# EAGLE schematic ATmega168_Nidec22H_BLDC_Motor (EAGLE 6.5.0)
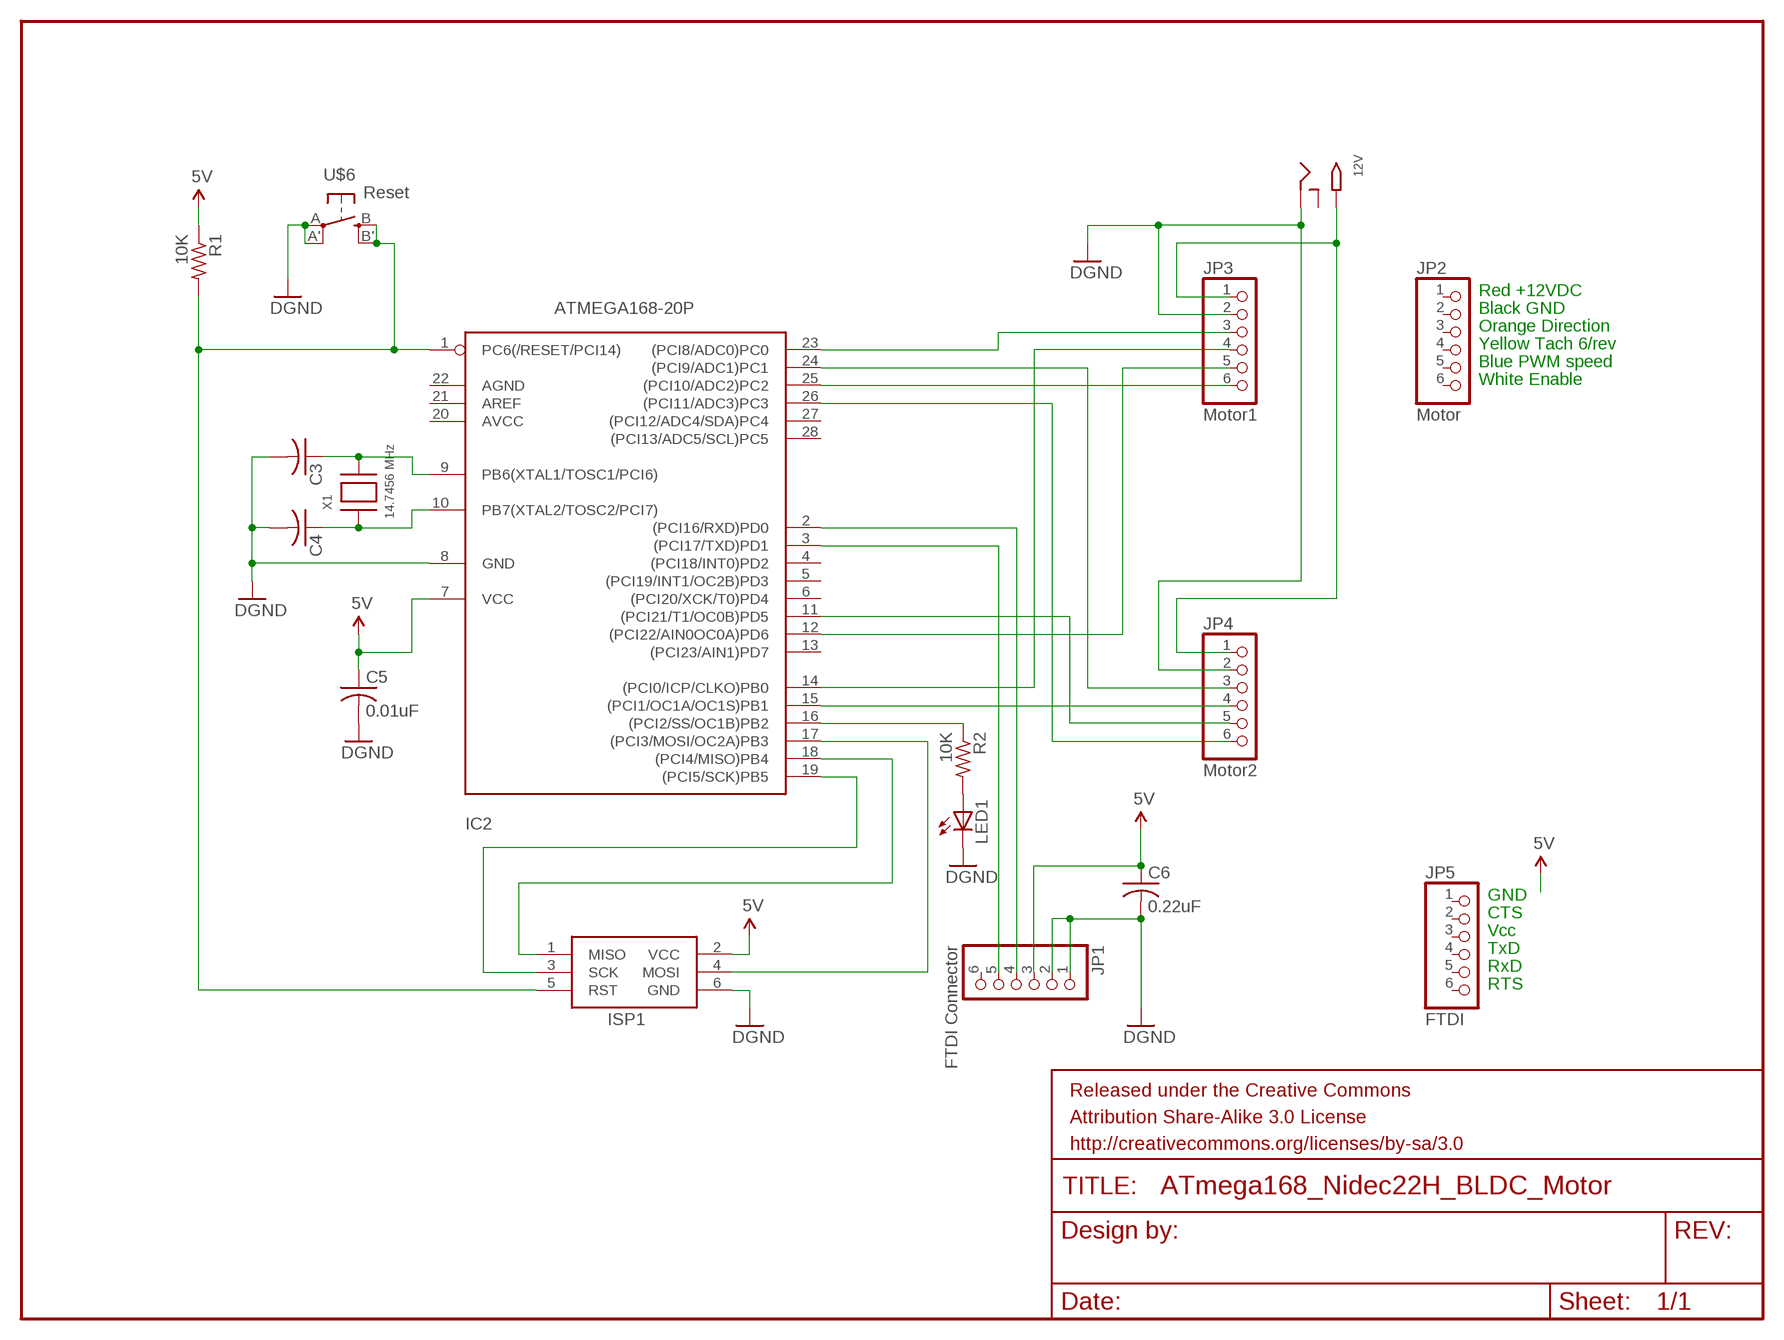
[diagram p0: schematic, sheet 1]

## Parts
12V  2.1MMJACKSMT  [DCJACK_2MM_SMT]
C3  C-US025-024X044  [C025-024X044]
C4  C-US025-024X044  [C025-024X044]
C5  0.01uF  C-US025-024X044  [C025-024X044]
C6  0.22uF  C-US025-024X044  [C025-024X044]
IC2  ATMEGA168-20P  [DIL28-3]
ISP1  AVRISP-6  [AVRISP]
JP1  FTDI Connector  PINHD-1X6  [1X06]
JP2  Motor  PINHD-1X6  [1X06]
JP3  Motor1  PINHD-1X6  [1X06]
JP4  Motor2  PINHD-1X6  [1X06]
JP5  FTDI  PINHD-1X6  [1X06]
LED1  LED5MM  [LED5MM]
R1  10K  R-US_V234/12  [V234/12]
R2  10K  R-US_V234/12  [V234/12]
U$6  Reset  EVQQ2  [EVQ-Q2]
X1  14.7456 MHz  XTALNX8045  [NX8045]

## Nets
5V: C5.1 C6.1 IC2.7(VCC) ISP1.2(VCC) JP1.3 R1.1
24V: 12V.PWR2(TIP) JP3.1 JP4.1
DIR-1: IC2.23((PCI8/ADC0)PC0) JP3.3
DIR-2: IC2.24((PCI9/ADC1)PC1) JP4.3
EN-1: IC2.25((PCI10/ADC2)PC2) JP3.6
EN-2: IC2.26((PCI11/ADC3)PC3) JP4.6
GND: 12V.GND(RING) C3.2 C4.2 C5.2 C6.2 IC2.8(GND) ISP1.6(GND) JP1.1 JP1.2 JP3.2 JP4.2 LED1.K(C) U$6.A'(P1) U$6.A(P) ; supply symbol labelled DGND
MISO: IC2.18((PCI4/MISO)PB4) ISP1.1(MISO)
MOSI: IC2.17((PCI3/MOSI/OC2A)PB3) ISP1.4(MOSI)
N$1: IC2.16((PCI2/SS/OC1B)PB2) R2.1
N$3: C3.1 IC2.9(PB6(XTAL1/TOSC1/PCI6)) X1.P$2
N$4: C4.1 IC2.10(PB7(XTAL2/TOSC2/PCI7)) X1.P$1
N$13: LED1.A R2.2
PWM-1: IC2.12((PCI22/AIN0OC0A)PD6) JP3.5
PWM-2: IC2.11((PCI21/T1/OC0B)PD5) JP4.5
RST: IC2.1(PC6(/RESET/PCI14)) ISP1.5(RST) R1.2 U$6.B'(S1) U$6.B(S)
RXD: IC2.3((PCI17/TXD)PD1) JP1.5
SCK: IC2.19((PCI5/SCK)PB5) ISP1.3(SCK)
TACH-1: IC2.14((PCI0/ICP/CLKO)PB0) JP3.4
TACH-2: IC2.15((PCI1/OC1A/OC1S)PB1) JP4.4
TXD: IC2.2((PCI16/RXD)PD0) JP1.4
Unconnected: 12V.GNDBREAK(RING_SW) IC2.4((PCI18/INT0)PD2) IC2.5((PCI19/INT1/OC2B)PD3) IC2.6((PCI20/XCK/T0)PD4) IC2.13((PCI23/AIN1)PD7) IC2.20(AVCC) IC2.21(AREF) IC2.22(AGND) IC2.27((PCI12/ADC4/SDA)PC4) IC2.28((PCI13/ADC5/SCL)PC5) JP1.6 JP2.1 JP2.2 JP2.3 JP2.4 JP2.5 JP2.6 JP5.1 JP5.2 JP5.3 JP5.4 JP5.5 JP5.6

## Notes on the sheet
- Red +12VDC
- Black GND
- Orange Direction
- Yellow Tach 6/rev
- Blue PWM speed
- White Enable
- GND
- CTS
- Vcc
- TxD
- RxD
- RTS

## Library data of the parts
12V = adafruit:2.1MMJACK: 2.1mm x 5.5mm THM DC jack with internal switch. Digikey part #PJ-102A, 4UCON part #05537 2.1mm x 5.5mm SMT DC jack with internal switch. Digikey part #PJ-002A-SMT, 4UCON part #03267 By microbuilder.eu & adafruit.com
C3-C6 = rcl:C-US: CAPACITOR, American symbol
IC2 = adafruit:ATMEGA168*P: MICROCONTROLLER 16 kBytes FLASH 1 kBytes SRAM 512 Bytes EEPROM USART 8-channel 10 bit ADC
ISP1 = adafruit:AVRISP: AVR ISP HEADER Standard 6 pin header for AVR programming
JP1-JP5 = adafruit:PINHD-1X6: PIN HEADER
LED1 = adafruit:LED: LED OSRAM: - CHIPLED LG R971, LG N971, LY N971, LG Q971, LY Q971, LO R971, LY R971 LH N974, LH R974 LS Q976, LO Q976, LY Q976 LO Q996 - Hyper CHIPLED LW Q18S LB Q993, LB Q99A, LB R99A - SideLED LS A670, LO A670, LY A670, LG A670, LP A670 LB A673, LV A673, LT A673, LW A673 LH A674 LY A675 LS A676, LA A676, LO A676, LY A676, LW A676 LS A679, LY A679, LG A679 - Hyper Micro SIDELED® LS Y876, LA Y876, LO Y876, LY Y876 LT Y87S - SmartLED LW L88C, LW L88S LB L89C, LB L89S, LG L890 LS L89K, LO L89K, LY L89K LS L896, LA L896, LO L896, LY L896 - TOPLED LS T670, LO T670, LY T670, LG T670, LP T670 LSG T670, LSP T670, LSY T670, LOP T670, LYG T670 LG T671, LOG T671, LSG T671 LB T673, LV T673, LT T673, LW T673 LH T674 LS T676, LA T676, LO T676, LY T676, LB T676, LH T676, LSB T676, LW T676 LB T67C, LV T67C, LT T67C, LS T67K, LO T67K, LY T67K, LW E67C LS E67B, LA E67B, LO E67B, LY E67B, LB E67C, LV E67C, LT E67C LW T67C LS T679, LY T679, LG T679 LS T770, LO T770, LY T770, LG T770, LP T770 LB T773, LV T773, LT T773, LW T773 LH T774 LS E675, LA E675, LY E675, LS T675 LS T776, LA T776, LO T776, LY T776, LB T776 LHGB T686 LT T68C, LB T68C - Hyper Mini TOPLED® LB M676 - Mini TOPLED Santana® LG M470 LS M47K, LO M47K, LY M47K Source: http://www.osram.convergy.de/
R1 R2 = adafruit:R-US_: RESISTOR, American symbol
U$6 = adafruit:EVQQ2: SMT 6mm switch, EVQQ2 series http://www.ladyada.net/library/eagle
X1 = adafruit:XTAL: Low cost SMT crystals, no capacitors included http://www.ladyada.net/library/eagle